# Altium schematic sheet Resolver.SchDoc: Title
size A4; SchTemplateVer: V2.0; Author: Adam Mizerkiewicz; CompanyName: Adam Mizerkiewicz; DrawnBy: Adam Mizerkiewicz; Engineer: Adam Mizerkiewicz; Organization: Adam Mizerkiewicz; Address1: Sarnia 2/19; Address2: 61-058 Poznań; Revision: 0.0
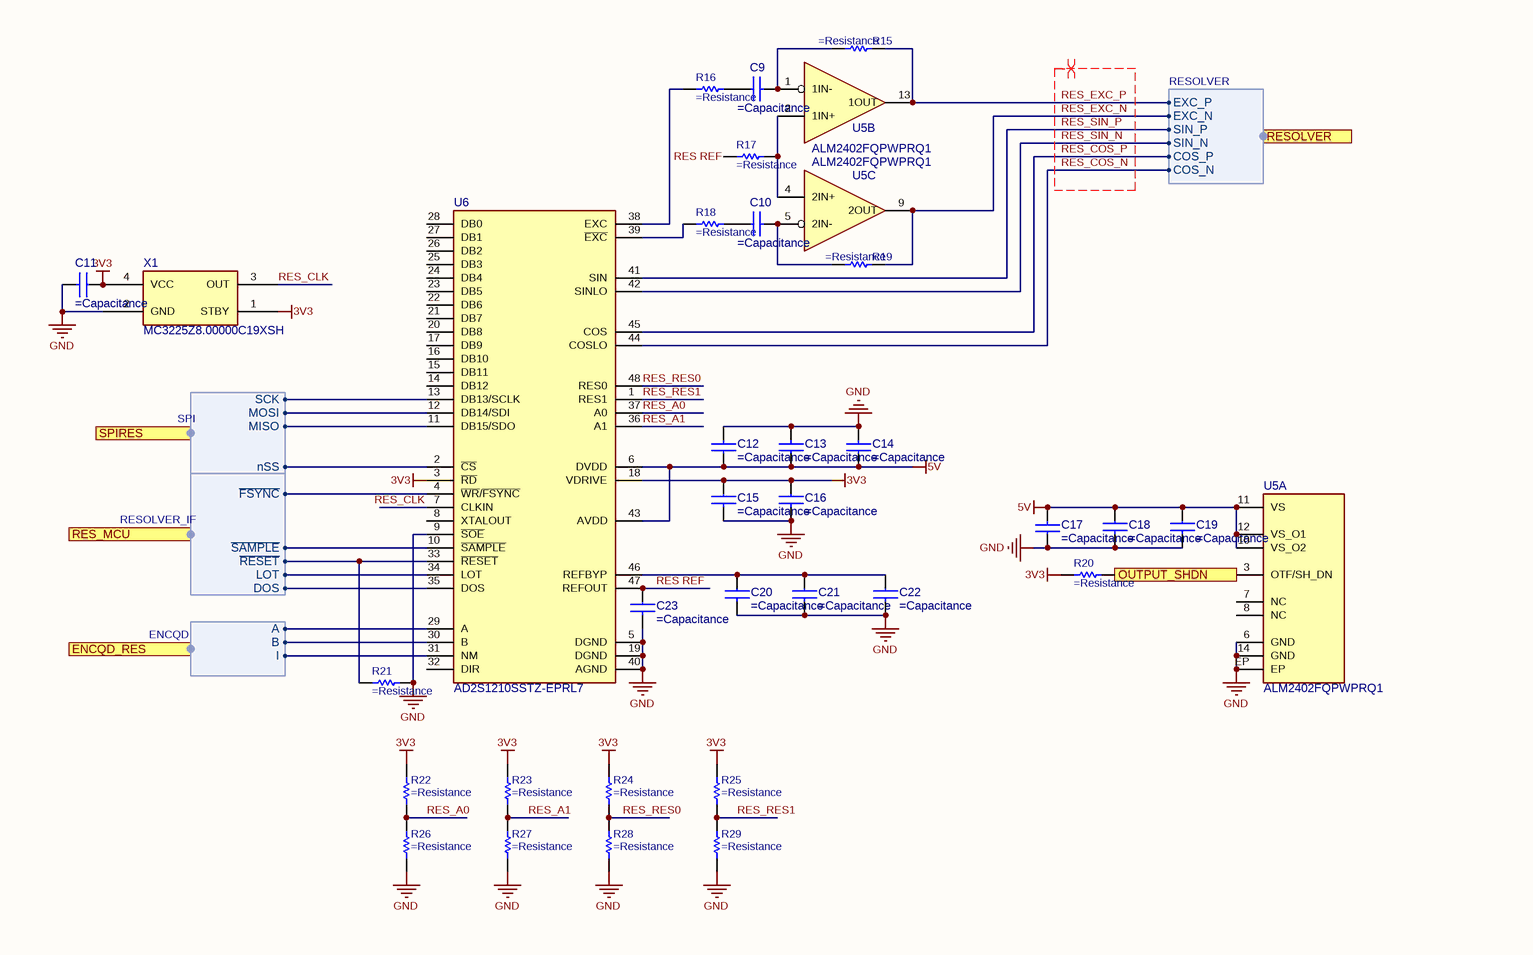
[diagram p0: Resolver.SchDoc, left]

## Parts
C9  (no value)  [C0402]
C10  (no value)  [C0402]
C11  (no value)  [C0402]
C12  (no value)  [C0402]
C13  (no value)  [C0402]
C14  (no value)  [C0402]
C15  (no value)  [C0402]
C16  (no value)  [C0402]
C17  (no value)  [C0402]
C18  (no value)  [C0402]
C19  (no value)  [C0402]
C20  (no value)  [C0402]
C21  (no value)  [C0402]
C22  (no value)  [C0402]
C23  (no value)  [C0402]
R15  (no value)  [R0402]
R16  (no value)  [R0402]
R17  (no value)  [R0402]
R18  (no value)  [R0402]
R19  (no value)  [R0402]
R20  (no value)  [R0402]
R21  (no value)  [R0402]
R22  (no value)  [R0402]
R23  (no value)  [R0402]
R24  (no value)  [R0402]
R25  (no value)  [R0402]
R26  (no value)  [R0402]
R27  (no value)  [R0402]
R28  (no value)  [R0402]
R29  (no value)  [R0402]
U5  ALM2402FQPWPRQ1  [TSSOP-14-EP]  (parts A,B,C of 3)
U6  AD2S1210SSTZ-EPRL7  [LQFP48]
X1  MC3225Z8.00000C19XSH  [MC3225Z]

## Ports
ENCQD_RES (harness ENCQD), OUTPUT_SHDN (in), RES_MCU (harness RESOLVER_IF), RESOLVER (harness RESOLVER), SPIRES (harness SPI)

## Harnesses
RESOLVER: EXC_P, EXC_N, SIN_P, SIN_N, COS_P, COS_N
SPI: MISO, MOSI, SCK, nSS
RESOLVER_IF: ~{SAMPLE}, ~{FSYNC}, ~{RESET}, LOT, DOS
ENCQD: B, A, I

## Nets
3V3: C11.1 C15.1 C16.1 R20.1 R22.2 R23.2 R24.2 R25.2 U6.3(~{RD}) U6.18(VDRIVE) X1.1(STBY) X1.4(VCC)
5V: C12.1 C13.1 C14.1 C17.2 C18.1 C19.1 U5.10(VS_O2) U5.11(VS) U5.12(VS_O1) U6.6(DVDD) U6.43(AVDD)
GND: C11.2 C12.2 C13.2 C14.2 C15.2 C16.2 C17.1 C18.2 C19.2 C20.2 C21.2 C22.2 C23.2 R21.1 R26.1 R27.1 R28.1 R29.1 U5.6(GND) U5.14(GND) U5.EP U6.5(DGND) U6.9(~{SOE}) U6.19(DGND) U6.40(AGND) X1.2(GND)
OUTPUT_SHDN: R20.2 U5.3(OTF/SH_DN) ; port OUTPUT_SHDN
RES REF: C23.1 R17.1 U6.47(REFOUT)
RES_A0: R22.1 R26.2 U6.37(A0)
RES_A1: R23.1 R27.2 U6.36(A1)
RES_CLK: U6.7(CLKIN) X1.3(OUT)
RES_COS_N: U6.44(COSLO) ; port RESOLVER.COS_N
RES_COS_P: U6.45(COS) ; port RESOLVER.COS_P
RES_EXC_N: R19.1 U5.9(2OUT) ; port RESOLVER.EXC_N
RES_EXC_P: R15.1 U5.13(1OUT) ; port RESOLVER.EXC_P
RES_RES0: R24.1 R28.2 U6.48(RES0)
RES_RES1: R25.1 R29.2 U6.1(RES1)
RES_SIN_N: U6.42(SINLO) ; port RESOLVER.SIN_N
RES_SIN_P: U6.41(SIN) ; port RESOLVER.SIN_P
NetC9_1: C9.1 R16.2
NetC9_2: C9.2 R15.2 U5.1(1IN-)
NetC10_1: C10.1 R18.2
NetC10_2: C10.2 R19.2 U5.5(2IN-)
NetC20_1: C20.1 C21.1 C22.1 U6.46(REFBYP)
NetR16_1: R16.1 U6.38(EXC)
NetR17_2: R17.2 U5.2(1IN+) U5.4(2IN+)
NetR18_1: R18.1 U6.39(~{EXC})
NetR21_2: R21.2 U6.33(~{RESET}) ; port RES_MCU.~{RESET}
NetU6_2: U6.2(~{CS}) ; port SPIRES.nSS
NetU6_4: U6.4(~{WR}/~{FSYNC}) ; port RES_MCU.~{FSYNC}
NetU6_10: U6.10(~{SAMPLE}) ; port RES_MCU.~{SAMPLE}
NetU6_11: U6.11(DB15/SDO) ; port SPIRES.MISO
NetU6_12: U6.12(DB14/SDI) ; port SPIRES.MOSI
NetU6_13: U6.13(DB13/SCLK) ; port SPIRES.SCK
NetU6_29: U6.29(A) ; port ENCQD_RES.A
NetU6_30: U6.30(B) ; port ENCQD_RES.B
NetU6_31: U6.31(NM) ; port ENCQD_RES.I
NetU6_34: U6.34(LOT) ; port RES_MCU.LOT
NetU6_35: U6.35(DOS) ; port RES_MCU.DOS

Not connected (* = marked no-connect by the designer): U5 7(NC) 8(NC); U6 8(XTALOUT) 14(DB12) 15(DB11) 16(DB10) 17(DB9) 20(DB8) 21(DB7) 22(DB6) 23(DB5) 24(DB4) 25(DB3) 26(DB2) 27(DB1) 28(DB0) 32(DIR)

## Layout directives
differential pair: RES_COS_N, RES_COS_P, RES_EXC_N, RES_EXC_P, RES_SIN_N, RES_SIN_P

## Notes on the sheet
- Revision
  =Revision
- Sheet
  =SheetNumber / =SheetTotal

## Library data of the parts
C9-C13 C15 C18 C19 C23 = CAP0402-0.1uF-50V: CAP CER 0.1UF 50V X7R 0402; Manufacturer: Walsin Technologies; Manufacturer Part Number: 0402B104K500CT; Capacitance: 100nF; Material: 4241ConductorMaterial; Value: 100nF; Tolerance: 10%; Dielectric: 1511DielectricType; Supplier: Digikey; Supplier Part Number: 1292-1176-1-ND; RoHS: Yes; Category: Ceramic Capacitors; Stock: 109567; Pricing: 1=0,08, 10=0,005, 100=0,0032, 1000=0,0024 (USD); Mounting Technology: Surface Mount; Case/Package: 0402; Case Code (Imperial): 0402; Case Code (Metric): 1005; Min Operating Temperature: -55°C; Max Operating Temperature: 125°C; Packaging: Cut Tape; Voltage Rating: 50V; Series: -; Voltage Rating (DC): 50V; Height: 550um; RoHS Compliant: Yes; Lead Free: 5697LeadFree; ComponentLink1URL: http://datasheet.octopart.com/0402B104K500CT-Walsin-Technologies-datasheet-26371553.pdf?src-supplier=Arrow+Electronics; ComponentLink1Description: http://datasheet.octopart.com/0402B104K500CT-Walsin-Technologies-datasheet-26371553.pdf?src-supplier=Arrow+Electronics; ComponentLink2URL: http://datasheet.octopart.com/0402B104K500CT-Walsin-Technologies-datasheet-26371553.pdf?src-supplier=Verical; ComponentLink2Description: http://datasheet.octopart.com/0402B104K500CT-Walsin-Technologies-datasheet-26371553.pdf?src-supplier=Verical; ComponentLink3URL: http://www.passivecomponent.com/indexsea/0402B104K500CT-IE.pdf?src-supplier=Digikey; ComponentLink3Description: http://www.passivecomponent.com/indexsea/0402B104K500CT-IE.pdf?src-supplier=Digikey; ComponentLink4URL: http://datasheet.octopart.com/0402B104K500CT-Walsin-Technologies-datasheet-26371553.pdf?src-supplier=Rs; ComponentLink4Description: http://datasheet.octopart.com/0402B104K500CT-Walsin-Technologies-datasheet-26371553.pdf?src-supplier=Rs; ComponentLink5URL: https://datasheet.octopart.com/0402B104K500CT-Walsin-Technologies-datasheet-128065749.pdf?src-supplier=Future+Electronics; ComponentLink5Description: https://datasheet.octopart.com/0402B104K500CT-Walsin-Technologies-datasheet-128065749.pdf?src-supplier=Future+Electronics; ComponentLink6URL: http://datasheet.octopart.com/0402B104K500CT-Walsin-Technologies-datasheet-26371553.pdf?src-supplier=Farnell; ComponentLink6Description: http://datasheet.octopart.com/0402B104K500CT-Walsin-Technologies-datasheet-26371553.pdf?src-supplier=Farnell; ComponentLink7URL: http://datasheet.octopart.com/0402B104K500CT-Walsin-Technologies-datasheet-26371553.pdf?src-supplier=Newark; ComponentLink7Description: http://datasheet.octopart.com/0402B104K500CT-Walsin-Technologies-datasheet-26371553.pdf?src-supplier=Newark; ComponentLink8URL: http://datasheet.octopart.com/0402B104K500CT-Walsin-Technologies-datasheet-26371553.pdf?src-supplier=Mouser; ComponentLink8Description: http://datasheet.octopart.com/0402B104K500CT-Walsin-Technologies-datasheet-26371553.pdf?src-supplier=Mouser; ComponentLink9URL: http://datasheet.octopart.com/0402B104K500CT-Walsin-Technologies-datasheet-26371553.pdf?src-supplier=Digikey; ComponentLink9Description: http://datasheet.octopart.com/0402B104K500CT-Walsin-Technologies-datasheet-26371553.pdf?src-supplier=Digikey; ComponentLink10URL: https://datasheet.octopart.com/0402B104K500CT-Walsin-Technologies-datasheet-62066062.pdf?src-supplier=TME; ComponentLink10Description: https://datasheet.octopart.com/0402B104K500CT-Walsin-Technologies-datasheet-62066062.pdf?src-supplier=TME; ComponentLink11URL: http://datasheet.octopart.com/0402B104K500CT-Walsin-Technologies-datasheet-26371553.pdf?src-supplier=Freelance+Electronics; ComponentLink11Description: http://datasheet.octopart.com/0402B104K500CT-Walsin-Technologies-datasheet-26371553.pdf?src-supplier=Freelance+Electronics; ComponentLink12URL: http://datasheet.octopart.com/0402B104K500CT-Walsin-Technologies-datasheet-26371553.pdf?src-supplier=Component+Sense; ComponentLink12Description: http://datasheet.octopart.com/0402B104K500CT-Walsin-Technologies-datasheet-26371553.pdf?src-supplier=Component+Sense; ComponentLink13URL: http://datasheet.octopart.com/0402B104K500CT-Walsin-Technologies-datasheet-26371553.pdf?src-supplier=NAC+Semi; ComponentLink13Description: http://datasheet.octopart.com/0402B104K500CT-Walsin-Technologies-datasheet-26371553.pdf?src-supplier=NAC+Semi; ComponentLink14URL: https://datasheet.octopart.com/0402B104K500CT-Walsin-Technologies-datasheet-136037192.pdf?src-supplier=TECHDesign; ComponentLink14Description: https://datasheet.octopart.com/0402B104K500CT-Walsin-Technologies-datasheet-136037192.pdf?src-supplier=TECHDesign; Supplier 1: Digikey; Supplier Part Number 1: 1292-1176-1-ND
C14 C16 C17 C21 C22 = CAP0402-4.7uF-10V: Ceramic Capacitor, Ceramic, 10V, 10% +Tol, 10% -Tol, X5R, 15% TC, 4.7uF, Surface Mount, 0402; Manufacturer: Yageo Group; Manufacturer Part Number: CC0402KRX5R6BB475; Capacitance: 4.7µF; Value: 4.7µF; Temperature Coefficient: 30ppm/°C; Supplier 1: DigiKey; Supplier Part Number 1: 13-CC0402KRX5R6BB475DKR-ND; Supplier: DigiKey; Supplier Part Number: 13-CC0402KRX5R6BB475DKR-ND; RoHS: Compliant; Category: Ceramic Capacitors; Pricing: 1=0,11, 10=0,063, 50=0,0438, 100=0,038, 500=0,02808, 1000=0,02628, 2500=0,02393, 5000=0,02325 (USD); Case/Package: 0402; China RoHS: Compliant; Dielectric: X5R; Dielectric Material: Ceramic; Halogen Free: Halogen Free; Height: 500µm; Lead Free: Lead Free; Length: 1mm; Lifecycle Status: Production; Material: Ceramic; Max Operating Temperature: 85°C; Min Operating Temperature: -55°C; Mounting Technology: Surface Mount; Number of Terminals: 2; REACH SVHC: Yes; Voltage Rating: 10V; Voltage Rating (DC): 10V; Width: 500µm; ComponentLink1URL: https://datasheet.octopart.com:443/CC0402KRX5R6BB475-Yageo-datasheet-170350636.pdf?src-supplier=Future+Electronics; ComponentLink1Description: https://datasheet.octopart.com:443/CC0402KRX5R6BB475-Yageo-datasheet-170350636.pdf?src-supplier=Future+Electronics; ComponentLink2URL: https://datasheet.octopart.com:443/CC0402KRX5R6BB475-Yageo-datasheet-82528541.pdf?src-supplier=Future+Electronics; ComponentLink2Description: https://datasheet.octopart.com:443/CC0402KRX5R6BB475-Yageo-datasheet-82528541.pdf?src-supplier=Future+Electronics; ComponentLink3URL: https://datasheet.octopart.com:443/CC0402KRX5R6BB475-Yageo-datasheet-78855684.pdf?src-supplier=Upverter; ComponentLink3Description: https://datasheet.octopart.com:443/CC0402KRX5R6BB475-Yageo-datasheet-78855684.pdf?src-supplier=Upverter; ComponentLink4URL: https://datasheet.octopart.com:443/CC0402KRX5R6BB475-Yageo-Group-datasheet-189192896.pdf?src-supplier=TME; ComponentLink4Description: https://datasheet.octopart.com:443/CC0402KRX5R6BB475-Yageo-Group-datasheet-189192896.pdf?src-supplier=TME; ComponentLink5URL: https://datasheet.octopart.com:443/CC0402KRX5R6BB475-Yageo-datasheet-182029407.pdf?src-supplier=Newark; ComponentLink5Description: https://datasheet.octopart.com:443/CC0402KRX5R6BB475-Yageo-datasheet-182029407.pdf?src-supplier=Newark; ComponentLink6URL: https://datasheet.octopart.com:443/CC0402KRX5R6BB475-Yageo-datasheet-158238148.pdf?src-supplier=Newark; ComponentLink6Description: https://datasheet.octopart.com:443/CC0402KRX5R6BB475-Yageo-datasheet-158238148.pdf?src-supplier=Newark; ComponentLink7URL: https://datasheet.octopart.com:443/CC0402KRX5R6BB475-Yageo-Group-datasheet-145016144.pdf?src-supplier=ODG+(Origin+Data+Global); ComponentLink7Description: https://datasheet.octopart.com:443/CC0402KRX5R6BB475-Yageo-Group-datasheet-145016144.pdf?src-supplier=ODG+(Origin+Data+Global); ComponentLink8URL: https://datasheet.octopart.com/CC0402KRX5R6BB475-Yageo-datasheet-86397281.pdf; ComponentLink8Description: https://datasheet.octopart.com/CC0402KRX5R6BB475-Yageo-datasheet-86397281.pdf; ComponentLink9URL: http://sigma.octopart.com:80/rohs_statement/Yageo-company-2.pdf?src-supplier=Compliance+Statements; ComponentLink9Description: http://sigma.octopart.com:80/rohs_statement/Yageo-company-2.pdf?src-supplier=Compliance+Statements; ComponentLink10URL: http://sigma.octopart.com:80/conflict_mineral_statement/Yageo-company-3.pdf?src-supplier=Compliance+Statements; ComponentLink10Description: http://sigma.octopart.com:80/conflict_mineral_statement/Yageo-company-3.pdf?src-supplier=Compliance+Statements
C20 = CAP0402-10nF-25V: Multilayer Ceramic Capacitors MLCC - SMD/SMT 25V 0.01uF X7R 0402 10%; Manufacturer: KEMET; Manufacturer Part Number: C0402C103K3RALTU; Value: 10nF; Supplier 1: DigiKey; Supplier Part Number 1: 399-C0402C103K3RALTUCT-ND; Supplier: DigiKey; Supplier Part Number: 399-C0402C103K3RALTUCT-ND; Category: Ceramic Capacitors; Stock: 28368; Pricing: 1=0,32, 10=0,189, 50=0,1382, 100=0,1218, 500=0,09636, 1000=0,08824, 2500=0,0797, 5000=0,07454 (USD); Case/Package: 0402; Case Code (Imperial): 0402; Case Code (Metric): 1005; China RoHS: Non-Compliant; Contact Plating: Lead, Tin; Depth: 500µm; Dielectric: X7R; Dielectric Material: Ceramic; Height: 500µm; Lead Free: Contains Lead; Length: 1mm; Lifecycle Status: Production; Max Operating Temperature: 125°C; Min Operating Temperature: -55°C; Mounting Technology: Surface Mount; Number of Terminals: 2; REACH SVHC: No; RoHS: Non-Compliant; Schedule B: 8532240020, 8532240020|8532240020|8532240020|8532240020|8532240020; Termination: SMD/SMT; Thickness: 558.8µm; Tolerance: 10%; Voltage Rating: 25V; Voltage Rating (DC): 25V; Width: 500µm; ComponentLink1URL: https://datasheet.octopart.com:443/C0402C103K3RALTU-KEMET-datasheet-178087941.pdf?src-supplier=Newark; ComponentLink1Description: https://datasheet.octopart.com:443/C0402C103K3RALTU-KEMET-datasheet-178087941.pdf?src-supplier=Newark; ComponentLink2URL: https://datasheet.octopart.com:443/C0402C103K3RALTU-KEMET-datasheet-83561407.pdf?src-supplier=Newark; ComponentLink2Description: https://datasheet.octopart.com:443/C0402C103K3RALTU-KEMET-datasheet-83561407.pdf?src-supplier=Newark; ComponentLink3URL: https://datasheet.octopart.com:443/C0402C103K3RALTU-KEMET-datasheet-169990498.pdf?src-supplier=Farnell; ComponentLink3Description: https://datasheet.octopart.com:443/C0402C103K3RALTU-KEMET-datasheet-169990498.pdf?src-supplier=Farnell; ComponentLink4URL: https://datasheet.octopart.com:443/C0402C103K3RALTU-KEMET-datasheet-86448206.pdf?src-supplier=Farnell; ComponentLink4Description: https://datasheet.octopart.com:443/C0402C103K3RALTU-KEMET-datasheet-86448206.pdf?src-supplier=Farnell; ComponentLink5URL: https://datasheet.octopart.com:443/C0402C103K3RALTU-KEMET-datasheet-181956020.pdf?src-supplier=Farnell; ComponentLink5Description: https://datasheet.octopart.com:443/C0402C103K3RALTU-KEMET-datasheet-181956020.pdf?src-supplier=Farnell; ComponentLink6URL: https://datasheet.octopart.com:443/C0402C103K3RALTU-Kemet-datasheet-62307648.pdf?src-supplier=element14+APAC; ComponentLink6Description: https://datasheet.octopart.com:443/C0402C103K3RALTU-Kemet-datasheet-62307648.pdf?src-supplier=element14+APAC; ComponentLink7URL: https://datasheet.octopart.com:443/C0402C103K3RALTU-KEMET-datasheet-157246124.pdf?src-supplier=Electro+Sonic; ComponentLink7Description: https://datasheet.octopart.com:443/C0402C103K3RALTU-KEMET-datasheet-157246124.pdf?src-supplier=Electro+Sonic; ComponentLink8URL: https://datasheet.octopart.com:443/C0402C103K3RALTU-KEMET-datasheet-142166266.pdf?src-supplier=Electro+Sonic; ComponentLink8Description: https://datasheet.octopart.com:443/C0402C103K3RALTU-KEMET-datasheet-142166266.pdf?src-supplier=Electro+Sonic; ComponentLink9URL: https://datasheet.octopart.com/C0402C103K3RALTU-KEMET-datasheet-84169754.pdf; ComponentLink9Description: https://datasheet.octopart.com/C0402C103K3RALTU-KEMET-datasheet-84169754.pdf; Capacitance: 10nF
R15 R16 R18 R19 R21 = RES0402-1k-1%: Res Thick Film 0402 1K Ohm 1% 0.063W(1/16W) ±50ppm/C Pad SMD Automotive T/R; Manufacturer: Vishay; Manufacturer Part Number: CRCW04021K00FHEDP; Resistance: 1kΩ; Max Power Dissipation: 63mW; Value: 1kΩ; Temperature Coefficient: 50ppm/°C; Voltage Rating: 50V; Supplier 1: DigiKey; Supplier Part Number 1: CRCW04021K00FHEDP-ND; Supplier: DigiKey; Supplier Part Number: CRCW04021K00FHEDP-ND; RoHS: Compliant; Category: Chip SMD Resistors; Pricing: 10000=0,03252 (USD); Case/Package: 0402; China RoHS: Non-Compliant; Composition: Thick Film; Contact Plating: Tin; Depth: 500µm; Features: Automotive AEC-Q200; Height: 350µm; Length: 990.6µm; Lifecycle Status: Production; Max Operating Temperature: 155°C; Military Standard: Not; Min Operating Temperature: -55°C; Mounting Technology: Surface Mount; Number of Terminals: 2; Number of Terminations: 2; Packaging: Tape & Reel; Power Dissipation: 63mW; Power Rating: 63mW; Radiation Hardening: No; REACH SVHC: Yes; Tolerance: 1%; Width: 500µm; Working Voltage: 50V; ComponentLink1URL: https://datasheet.octopart.com:443/CRCW04021K00FHEDP-Vishay-datasheet-182027415.pdf?src-supplier=IHS; ComponentLink1Description: https://datasheet.octopart.com:443/CRCW04021K00FHEDP-Vishay-datasheet-182027415.pdf?src-supplier=IHS; ComponentLink2URL: https://datasheet.octopart.com:443/CRCW04021K00FHEDP-Vishay-Dale-datasheet-141207190.pdf?src-supplier=Upverter; ComponentLink2Description: https://datasheet.octopart.com:443/CRCW04021K00FHEDP-Vishay-Dale-datasheet-141207190.pdf?src-supplier=Upverter; ComponentLink3URL: http://sigma.octopart.com:80/rohs_statement/Vishay-company-15.pdf?src-supplier=Compliance+Statements; ComponentLink3Description: http://sigma.octopart.com:80/rohs_statement/Vishay-company-15.pdf?src-supplier=Compliance+Statements
R17 R22-R29 = RES0402-0-1%: Zero Ohm Resistor, Jumper, 0402 [1005 Metric], Thick Film, 63 mW, 1 A, Surface Mount Device; Manufacturer: Yageo Group; Manufacturer Part Number: RC0402JR-100RL; Resistance: 0Ω; Power Dissipation: 62.5mW; Value: 0Ω; Tolerance: 5%; Supplier 1: DigiKey; Supplier Part Number 1: 13-RC0402JR-100RLCT-ND; Supplier: DigiKey; Supplier Part Number: 13-RC0402JR-100RLCT-ND; RoHS: Compliant; Category: Chip SMD Resistors; Stock: 16047; Pricing: 1=0,1, 10=0,007, 25=0,0052, 50=0,003, 100=0,0028 (USD); Case/Package: 0402; China RoHS: Non-Compliant; Composition: Thick Film; Depth: 500µm; Height: 350µm; Length: 1mm; Lifecycle Status: Production; Max Operating Temperature: 155°C; Military Standard: Not; Min Operating Temperature: -55°C; Mounting Technology: Surface Mount; Number of Terminals: 2; REACH SVHC: Yes; Width: 500µm; ComponentLink1URL: https://datasheet.octopart.com:443/RC0402JR-100RL-Yageo-datasheet-182189538.pdf?src-supplier=IHS; ComponentLink1Description: https://datasheet.octopart.com:443/RC0402JR-100RL-Yageo-datasheet-182189538.pdf?src-supplier=IHS; ComponentLink2URL: https://datasheet.octopart.com:443/RC0402JR-100RL-Yageo-datasheet-164759695.pdf?src-supplier=Future+Electronics; ComponentLink2Description: https://datasheet.octopart.com:443/RC0402JR-100RL-Yageo-datasheet-164759695.pdf?src-supplier=Future+Electronics; ComponentLink3URL: https://datasheet.octopart.com:443/RC0402JR-100RL-Yageo-datasheet-141265859.pdf?src-supplier=Future+Electronics; ComponentLink3Description: https://datasheet.octopart.com:443/RC0402JR-100RL-Yageo-datasheet-141265859.pdf?src-supplier=Future+Electronics; ComponentLink4URL: https://datasheet.octopart.com:443/RC0402JR-100RL-Yageo-datasheet-148775077.pdf?src-supplier=element14+APAC; ComponentLink4Description: https://datasheet.octopart.com:443/RC0402JR-100RL-Yageo-datasheet-148775077.pdf?src-supplier=element14+APAC; ComponentLink5URL: https://datasheet.octopart.com/RC0402JR-100RL-Yageo-datasheet-73766026.pdf; ComponentLink5Description: https://datasheet.octopart.com/RC0402JR-100RL-Yageo-datasheet-73766026.pdf; ComponentLink6URL: http://sigma.octopart.com:80/rohs_statement/Yageo-company-2.pdf?src-supplier=Compliance+Statements; ComponentLink6Description: http://sigma.octopart.com:80/rohs_statement/Yageo-company-2.pdf?src-supplier=Compliance+Statements; ComponentLink7URL: http://sigma.octopart.com:80/conflict_mineral_statement/Yageo-company-3.pdf?src-supplier=Compliance+Statements; ComponentLink7Description: http://sigma.octopart.com:80/conflict_mineral_statement/Yageo-company-3.pdf?src-supplier=Compliance+Statements
R20 = RES0402-10k-1%: Res Thick Film 0402 10K Ohm 1% 0.063W(1/16W) ±100ppm/C Pad SMD T/R Automotive AEC-Q200; Manufacturer: Vishay; Manufacturer Part Number: CRCW040210K0FKEE; Resistance: 10kΩ; Max Power Dissipation: 63mW; Value: 10kΩ; Temperature Coefficient: 100ppm/°C; Voltage Rating: 50V; Supplier 1: DigiKey; Supplier Part Number 1: 541-2954-1-ND; Supplier: DigiKey; Supplier Part Number: 541-2954-1-ND; RoHS: Compliant; Category: Chip SMD Resistors; Pricing: 1=0,1, 10=0,03, 25=0,0224, 50=0,018, 100=0,0148, 250=0,01156, 500=0,00974, 1000=0,00832, 5000=0,00637 (USD); Case/Package: 0402; Case Code (Imperial): 0402; Case Code (Metric): 1005; China RoHS: Non-Compliant; Composition: Thick Film; Contact Plating: Tin; Depth: 500µm; Features: Automotive AEC-Q200; Height: 350µm; Lead Free: Lead Free; Length: 990.6µm; Lifecycle Status: Production; Max Operating Temperature: 155°C; Military Standard: Not; Min Operating Temperature: -55°C; Mounting Technology: Surface Mount; Number of Terminals: 2; Number of Terminations: 2; Packaging: Tape & Reel; Power Dissipation: 63mW; Power Rating: 63mW; Radiation Hardening: No; REACH SVHC: Yes; Schedule B: 8533210045, 8533210045|8533210045|8533210045|8533210045|8533210045|8533210045|8533210045|8533210045|8533210045|8533210045|8533210045|8533210045|8533210045|8533210045|8533210045|8533210045|8533210045|8533210045|8533210045|8533210045|8533210045|8533210045|8533210045|85; Tolerance: 1%; Voltage Rating (DC): 50V; Width: 500µm; Working Voltage: 50V; ComponentLink1URL: https://datasheet.octopart.com:443/CRCW040210K0FKEE-Vishay-datasheet-175423584.pdf?src-supplier=IHS; ComponentLink1Description: https://datasheet.octopart.com:443/CRCW040210K0FKEE-Vishay-datasheet-175423584.pdf?src-supplier=IHS; ComponentLink2URL: https://datasheet.octopart.com:443/CRCW040210K0FKEE-Vishay-datasheet-62316122.pdf?src-supplier=Future+Electronics; ComponentLink2Description: https://datasheet.octopart.com:443/CRCW040210K0FKEE-Vishay-datasheet-62316122.pdf?src-supplier=Future+Electronics; ComponentLink3URL: http://sigma.octopart.com:80/rohs_statement/Vishay-company-15.pdf?src-supplier=Compliance+Statements; ComponentLink3Description: http://sigma.octopart.com:80/rohs_statement/Vishay-company-15.pdf?src-supplier=Compliance+Statements
U5 = ALM2402F-Q1: Dual operational amplifier with high current output and slew rate 14-HTSSOP -40 to 125; Manufacturer: Texas Instruments; Manufacturer Lifecycle Status: ACTIVE; Input Bias Current: 3.5nA; Input Offset Voltage (Vos): 1mV; Max Supply Voltage: 16V; Min Supply Voltage: 4.5V; Number of Channels: 2; Output Current per Channel: 400mA; Response Time: 2µs; Voltage Gain: 93dB; Supplier 1: DigiKey; Supplier Part Number 1: 296-ALM2402FQPWPRQ1CT-ND; Supplier: DigiKey; Supplier Part Number: 296-ALM2402FQPWPRQ1CT-ND; Manufacturer Part Number: ALM2402FQPWPRQ1; RoHS: Compliant; Category: Amplifiers - Op Amps, Buffer, Instrumentation; Stock: 2833; Pricing: 1=3,33, 10=2,502, 25=2,2952, 100=2,0672, 250=1,95848, 500=1,89296, 1000=1,83904 (USD); Ambient Temperature Range High: 125°C; Height: 1.2mm; Length: 5mm; Lifecycle Status: Production; Max Operating Temperature: 125°C; Min Operating Temperature: -40°C; Pins: 14; Thickness: 1mm; Width: 4.4mm; ComponentLink1URL: https://sigma.octopart.com:443/159569814/technical_drawing/Texas-Instruments-ALM2402FQPWPRQ1.pdf?src-supplier=Texas+Instruments; ComponentLink1Description: https://sigma.octopart.com:443/159569814/technical_drawing/Texas-Instruments-ALM2402FQPWPRQ1.pdf?src-supplier=Texas+Instruments; ComponentLink2URL: https://octopart.com:443/opatz8j6/c1?t=ZPJvvuPEpGpES_y9EoHHU01kErOd9eZN7Gx7z2LTZC5bpM9zJnn1LW-JbGqNri5mz2O5lzJ6UhfOc46BO5zOXJrvDKm0VlnxasqbOLQLOgbPoqEdQG3t9SYm2umos89xdDxf0XR27TUST3JNQlDir6P_KbZ1PxZHW9d-RdisXjF-EWsCDIFtIXJ6PS1KiiVKRk2qpXgEQkvnhlyRkUvVqJJgydVmn0OgYlFDpXYimEwaFlUpuIdaDGZmuFo_-uwRGj4YbJSrjYeBWO0Q_-UyrcG1wvn-j-xBbbnvHOa98eOF4czOQdpe2uraEiOfYVpG4pgI5ze8N1Yo4dbsKj3lJ-AfM_D9BxtgFVry6fSkeAtcCVjhbb--6O4yKaCOhRt7Vqt9W7T5dZ7d6Q&src-supplier=Texas+Instruments; ComponentLink2Description: https://octopart.com:443/opatz8j6/c1?t=ZPJvvuPEpGpES_y9EoHHU01kErOd9eZN7Gx7z2LTZC5bpM9zJnn1LW-JbGqNri5mz2O5lzJ6UhfOc46BO5zOXJrvDKm0VlnxasqbOLQLOgbPoqEdQG3t9SYm2umos89xdDxf0XR27TUST3JNQlDir6P_KbZ1PxZHW9d-RdisXjF-EWsCDIFtIXJ6PS1KiiVKRk2qpXgEQkvnhlyRkUvVqJJgydVmn0OgYlFDpXYimEwaFlUpuIdaDGZmuFo_-uwRGj4YbJSrjYeBWO0Q_-UyrcG1wvn-j-xBbbnvHOa98eOF4czOQdpe2uraEiOfYVpG4pgI5ze8N1Yo4dbsKj3lJ-AfM_D9BxtgFVry6fSkeAtcCVjhbb--6O4yKaCOhRt7Vqt9W7T5dZ7d6Q&src-supplier=Texas+Instruments; ComponentLink3URL: https://sigma.octopart.com:443/49250594/technical_drawing/Texas-Instruments-ALM2402FQPWPRQ1.pdf?src-supplier=Texas+Instruments; ComponentLink3Description: https://sigma.octopart.com:443/49250594/technical_drawing/Texas-Instruments-ALM2402FQPWPRQ1.pdf?src-supplier=Texas+Instruments; ComponentLink4URL: https://datasheet.octopart.com:443/ALM2402FQPWPRQ1-Texas-Instruments-datasheet-151121670.pdf?src-supplier=SHENGYU+ELECTRONICS; ComponentLink4Description: https://datasheet.octopart.com:443/ALM2402FQPWPRQ1-Texas-Instruments-datasheet-151121670.pdf?src-supplier=SHENGYU+ELECTRONICS; ComponentLink5URL: http://sigma.octopart.com:80/conflict_mineral_statement/Texas-Instruments-company-63.pdf?src-supplier=Compliance+Statements; ComponentLink5Description: http://sigma.octopart.com:80/conflict_mineral_statement/Texas-Instruments-company-63.pdf?src-supplier=Compliance+Statements; ComponentLink6URL: http://sigma.octopart.com:80/reach_statement/Texas-Instruments-company-64.pdf?src-supplier=Compliance+Statements; ComponentLink6Description: http://sigma.octopart.com:80/reach_statement/Texas-Instruments-company-64.pdf?src-supplier=Compliance+Statements
U6 = AD2S1210SSTZ-EPRL7: Variable Resolution, 10-Bit to 16-Bit R/D Converter with Reference Oscillator; Manufacturer: Analog Devices; Manufacturer Lifecycle Status: PRODUCTION; Interface: Parallel; Max Supply Voltage: 5.25V; Min Supply Voltage: 2.3V; Number of Channels: 2; Number of Converters: 1; Supplier 1: DigiKey; Supplier Part Number 1: 505-AD2S1210SSTZ-EPRL7CT-ND; Supplier: DigiKey; Supplier Part Number: 505-AD2S1210SSTZ-EPRL7CT-ND; Manufacturer Part Number: AD2S1210SSTZ-EPRL7; RoHS: Compliant; Category: Analog to Digital Converters (ADCs); Stock: 1388; Pricing: 1=36,68, 10=27,104, 25=24,95 (USD); Height: 1.6mm; Lifecycle Status: Production; Max Operating Temperature: 125°C; Min Operating Temperature: -40°C; Pins: 48; Schedule B: 8542390000, 8542390000|8542390000|8542390000|8542390000|8542390000|8542390000|8542390000|8542390000|8542390000|8542390000|8542390000|8542390000|8542390000|8542390000|8542390000|8542390000|8542390000|8542390000|8542390000|8542390000|8542390000|8542390000|8542390000|85; ComponentLink1URL: https://octopart.com:443/opatz8j6/c1?t=k6fJq6adrThdFycxtWTAnGFkOg80_DDUf2LogCT04gbzbe5BdBYrLFXnxFNandYyDPTV6rZWvFV2u5dAnLu4JsdXWEnecjpqc8hWMCwqGekMMp6kHhXDZa9P5HJITyOD5-VOaIhH71EaW9V9387lyfDJyPC-cQ1uiwGWwiloigfyQoUQQpcB8iB8RNLaBlcKqWrCL5SUsZXmx1U_xgDZKDZnY-eyE1vsltANIZMxL3YaJqaBAjg57PlAWL_CwrTWUsNp9kqOjzd23eczO6wHPI3Gh1TFdUTDlWJM4gP7Q3B-9ihoeQ81fcS2&src-supplier=Analog+Devices; ComponentLink1Description: https://octopart.com:443/opatz8j6/c1?t=k6fJq6adrThdFycxtWTAnGFkOg80_DDUf2LogCT04gbzbe5BdBYrLFXnxFNandYyDPTV6rZWvFV2u5dAnLu4JsdXWEnecjpqc8hWMCwqGekMMp6kHhXDZa9P5HJITyOD5-VOaIhH71EaW9V9387lyfDJyPC-cQ1uiwGWwiloigfyQoUQQpcB8iB8RNLaBlcKqWrCL5SUsZXmx1U_xgDZKDZnY-eyE1vsltANIZMxL3YaJqaBAjg57PlAWL_CwrTWUsNp9kqOjzd23eczO6wHPI3Gh1TFdUTDlWJM4gP7Q3B-9ihoeQ81fcS2&src-supplier=Analog+Devices; ComponentLink2URL: https://datasheet.octopart.com:443/AD2S1210SSTZ-EPRL7-Analog-Devices-datasheet-155502637.pdf?src-supplier=Upverter; ComponentLink2Description: https://datasheet.octopart.com:443/AD2S1210SSTZ-EPRL7-Analog-Devices-datasheet-155502637.pdf?src-supplier=Upverter; ComponentLink3URL: https://sigma.octopart.com:443/138896181/technical_drawing/Analog-Devices-AD2S1210SSTZ-EPRL7.pdf?src-supplier=Upverter; ComponentLink3Description: https://sigma.octopart.com:443/138896181/technical_drawing/Analog-Devices-AD2S1210SSTZ-EPRL7.pdf?src-supplier=Upverter; ComponentLink4URL: https://datasheet.octopart.com:443/AD2S1210SSTZ-EPRL7-Analog-Devices-datasheet-15541385.pdf?src-supplier=SHENGYU+ELECTRONICS; ComponentLink4Description: https://datasheet.octopart.com:443/AD2S1210SSTZ-EPRL7-Analog-Devices-datasheet-15541385.pdf?src-supplier=SHENGYU+ELECTRONICS; ComponentLink5URL: http://sigma.octopart.com:80/conflict_mineral_statement/Analog-Devices-company-33.pdf?src-supplier=Compliance+Statements; ComponentLink5Description: http://sigma.octopart.com:80/conflict_mineral_statement/Analog-Devices-company-33.pdf?src-supplier=Compliance+Statements; ComponentLink6URL: https://octopart.com:443/opatz8j6/c1?t=bUe-dHj52XTV9pQd6nvf8dvS-SlRDfG4kQbxo-JYlAUIf5xyTYN7Z74yZGolmkEVrRt14p2BUM1wYeKEmZ3p_PjBWAA9WCOR7G2CpJiKyGnar8Vuh7Hn9xVCu4BotM6DQhgv_nRphq5yYxQKxMDDqcZDafTpRiVNhaQkisKsT5PHNe5ktrcX3E6RzgxdIKQpGzV0TbFFt98g9YpT0LzNZjnccmwLyscWakWMjV_IP_gC4saAMPg4JPa585gSA3GixtayfKwqboOU7rvKB-6P3cz7o3LBbqMbDrEzvUjUsAv5-Xk-PQxoKxCz&src-supplier=Compliance+Statements; ComponentLink6Description: https://octopart.com:443/opatz8j6/c1?t=bUe-dHj52XTV9pQd6nvf8dvS-SlRDfG4kQbxo-JYlAUIf5xyTYN7Z74yZGolmkEVrRt14p2BUM1wYeKEmZ3p_PjBWAA9WCOR7G2CpJiKyGnar8Vuh7Hn9xVCu4BotM6DQhgv_nRphq5yYxQKxMDDqcZDafTpRiVNhaQkisKsT5PHNe5ktrcX3E6RzgxdIKQpGzV0TbFFt98g9YpT0LzNZjnccmwLyscWakWMjV_IP_gC4saAMPg4JPa585gSA3GixtayfKwqboOU7rvKB-6P3cz7o3LBbqMbDrEzvUjUsAv5-Xk-PQxoKxCz&src-supplier=Compliance+Statements
X1 = MC3225Z8.00000C19XSH: Crystal Oscillator 8MHz 1.8V/2.5V/3.3V 15pF 4-Pin SMD T/R; Manufacturer: KYOCERA AVX; Fall Time: 1.5ns; Frequency Stability: 30ppm; Low Level Output Current: 4mA; Max Supply Current: 6.5mA; Max Supply Voltage: 3.63V; Min Supply Voltage: 1.71V; Supplier 1: DigiKey; Supplier Part Number 1: 478-MC3225Z8.00000C19XSHCT-ND; Supplier: DigiKey; Supplier Part Number: 478-MC3225Z8.00000C19XSHCT-ND; Manufacturer Part Number: MC3225Z8.00000C19XSH; RoHS: Compliant; Category: Crystals; Stock: 5787; Pricing: 1=1,44, 10=1,248, 25=1,18, 50=1,131, 100=1,0842, 250=1,02532, 500=0,98292, 1000=0,9423 (USD); Frequency: 8MHz; Lifecycle Status: Production; Load Capacitance: 15pF; Max Operating Temperature: 125°C; Min Operating Temperature: -40°C; Mounting Technology: Surface Mount; Number of Terminals: 4; REACH SVHC: Yes; Rise Time: 1.5ns; ComponentLink1URL: https://datasheet.octopart.com:443/MC3225Z8.00000C19XSH-KYOCERA-AVX-datasheet-165896879.pdf?src-supplier=IHS; ComponentLink1Description: https://datasheet.octopart.com:443/MC3225Z8.00000C19XSH-KYOCERA-AVX-datasheet-165896879.pdf?src-supplier=IHS; ComponentLink2URL: https://datasheet.octopart.com:443/MC3225Z80.0000C19XSH-KYOCERA-AVX-datasheet-180539762.pdf?src-supplier=IHS; ComponentLink2Description: https://datasheet.octopart.com:443/MC3225Z80.0000C19XSH-KYOCERA-AVX-datasheet-180539762.pdf?src-supplier=IHS; ComponentLink3URL: https://datasheet.octopart.com:443/MC3225Z8.00000C19XSH-KYOCERA-AVX-datasheet-188906256.pdf?src-supplier=TME; ComponentLink3Description: https://datasheet.octopart.com:443/MC3225Z8.00000C19XSH-KYOCERA-AVX-datasheet-188906256.pdf?src-supplier=TME; ComponentLink4URL: http://sigma.octopart.com:80/reach_statement/AVX-company-19.pdf?src-supplier=Compliance+Statements; ComponentLink4Description: http://sigma.octopart.com:80/reach_statement/AVX-company-19.pdf?src-supplier=Compliance+Statements; ComponentLink5URL: http://sigma.octopart.com:80/conflict_mineral_statement/AVX-company-34.pdf?src-supplier=Compliance+Statements; ComponentLink5Description: http://sigma.octopart.com:80/conflict_mineral_statement/AVX-company-34.pdf?src-supplier=Compliance+Statements